# EAGLE design air quality (EAGLE 5.11)
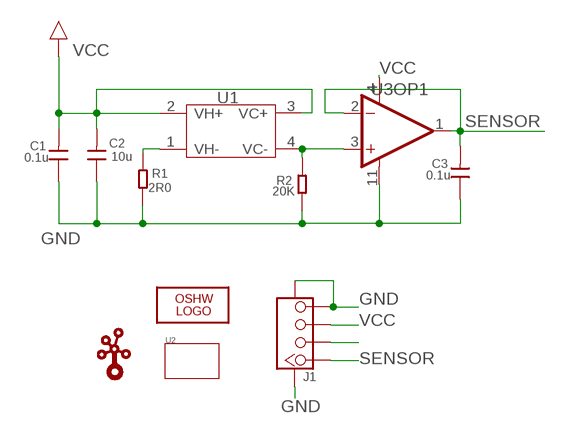
[diagram p0: schematic, sheet 1]

## Parts
C1  0.1u  C-0603  [0603]
C2  10u  C-0603  [0603]
C3  0.1u  C-0603  [0603]
J1  TWIG-4P-2.0-SMD-FEMALE-REINFORCE'90D'  [4P-SMD-2.0-90D]
LOGO1  LOGO-OSHW-FILLX0200-NT  [OSHW_FILLX200_NOTEXT]
R1  2R0  R-0805  [0805]
R2  20K  R-0603  [0603]
U1  SENSOR-TP-401  [4P-9.4MM]
U2  TWIG-2U  [2U-DIM-W/-DRILL]
U3  LMV324  [SO014]
U$1  LOGO-TWIG  [TWIGLOGO]

## Nets
GND: C1.1 C2.1 C3.1 J1.4 J1.SS1 J1.SS2 R1.1 R2.1 U3.11(OP1:V-)
N$1: R1.2 U1.1(VH-)
N$4: R2.2 U1.4(VC-) U3.3(OP1:IN+)
SENSOR: C3.2 J1.1 U3.1(OP1:OUT) U3.2(OP1:IN-)
TEMP: J1.2
VCC: C1.2 C2.2 J1.3 U1.2(VH+) U1.3(VC+) U3.4(OP1:V+) ; supply symbol labelled POWER_ARROW
Unconnected: U3.5(OP3:IN+) U3.6(OP3:IN-) U3.7(OP3:OUT) U3.8(OP2:OUT) U3.9(OP2:IN-) U3.10(OP2:IN+) U3.12(OP4:IN+) U3.13(OP4:IN-) U3.14(OP4:OUT)

## Library data of the parts
C1-C3 = Discrete:C*: Ceramic Capacitors
J1 = Connector:TWIG-4P-2.0-SMD-FEMALE-REINFORCE
LOGO1 = logo:LOGO-OSHW-FILL
R1 R2 = Discrete:R*
U1 = Discrete:SENSOR-TP-401
U2 = Module:TWIG
U3 = IC:LMV324
U$1 = logo:LOGO-TWIG

## Board
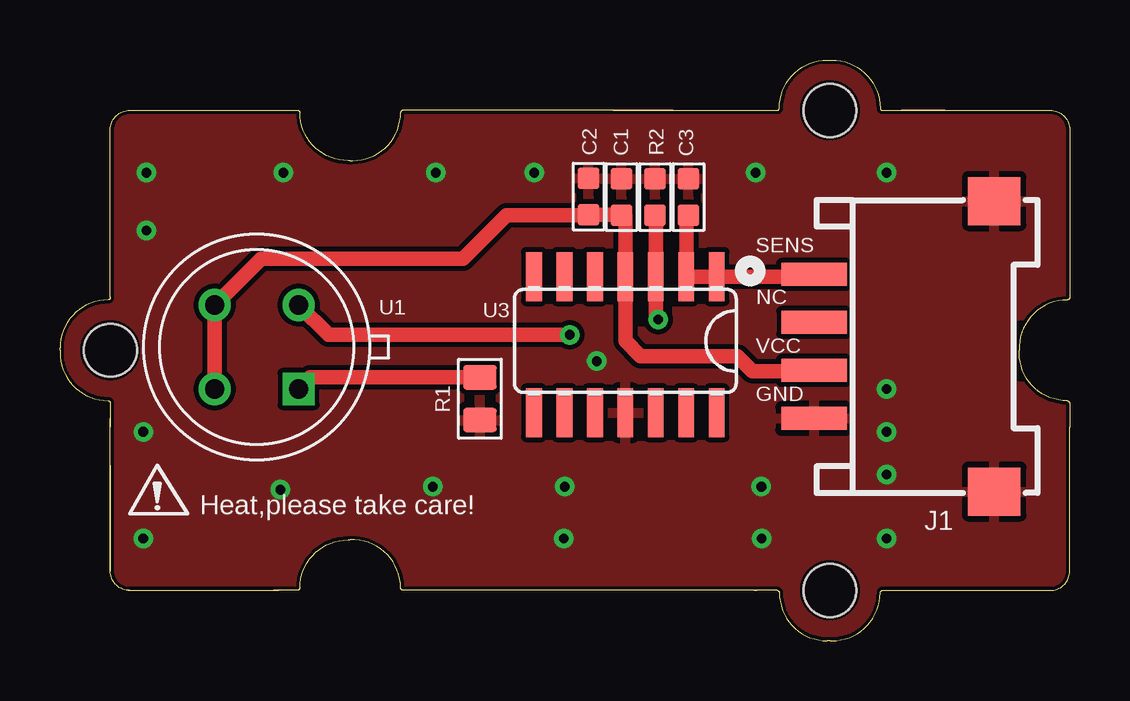
[diagram p1: board, top side]
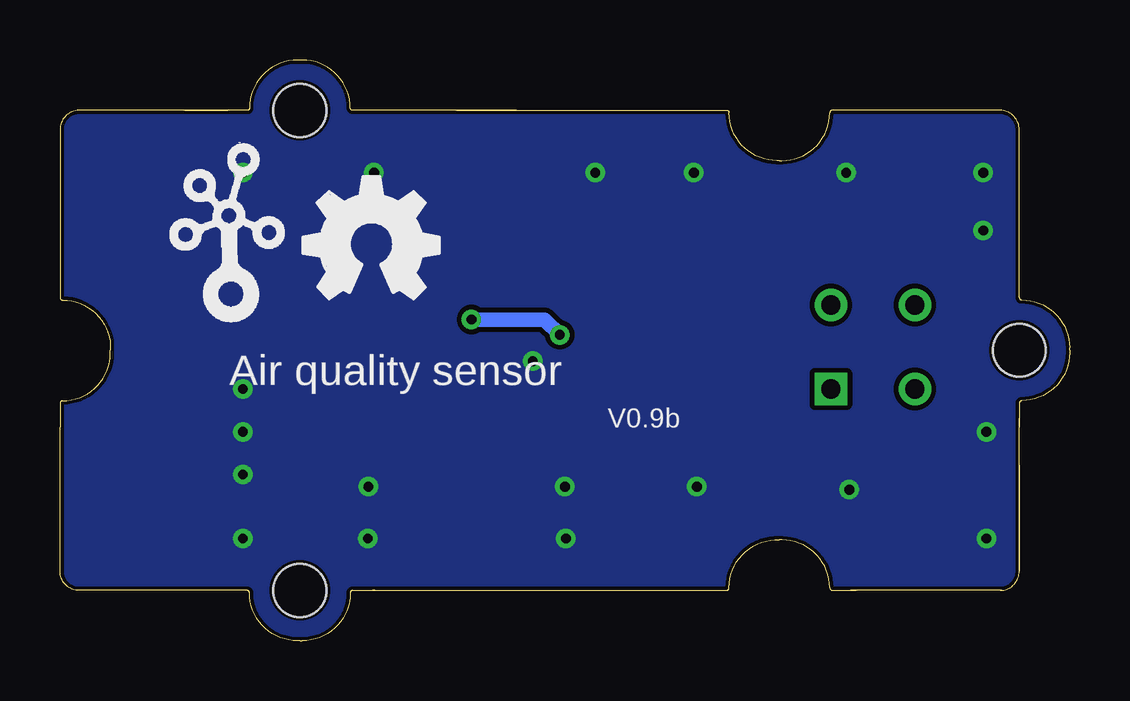
[diagram p2: board, bottom side, seen from below]

Size 42.09 x 24.2 mm. Coordinates in mm from the lower left corner, seen from the top.
Copper layers (1*16): Top 0.035mm / dielectric 1.5mm / Bottom 0.035mm
Design rules "default *": minimum track width 6mil, minimum drill 12mil, track to track 8mil, track to pad 8mil, pad to pad 8mil, via to via 8mil, smd to smd 8mil, copper to edge 6mil, drill to drill 8mil, minimum pad ring 10mil, minimum via ring 8mil, stop-mask expansion 4mil, vias tented up to drill 0mil, thermal gap 10mil

### Footprints (pad centres in the part's own frame; a part is rotated, then mirrored left to right if it is on the bottom)
0603 = smd 0.889 x 0.889: 1 -0.762,0; 2 0.762,0
4P-SMD-2.0-90D = smd 0.965 x 2.74: 1 -3,-0.1; 2 -1,-0.1; 3 1,-0.1; 4 3,-0.1 | smd 2 x 2.184: SS1 -6.05,7.4; SS2 6.05,7.4
0805 = smd 1.016 x 1.397: 1 -0.889,0; 2 0.889,0
4P-9.4MM = drill 0.8 pad 1.35 square: 1 -1.75,-1.75 | drill 0.8 pad 1.35 round: 2 -1.75,1.75; 3 1.75,1.75; 4 1.75,-1.75
2U-DIM-W/-DRILL = hole 2.2: 10.453,-10.42; 10.453,9.58; -19.535,-0.415
SO014 = smd 0.66 x 2.032: 1 -3.175,-2.68; 2 -1.905,-2.68; 3 -0.635,-2.68; 4 0.635,-2.68; 5 1.905,-2.68; 6 3.175,-2.68; 7 4.445,-2.68; 8 4.445,2.997; 9 3.175,2.997; 10 1.905,2.997; 11 0.635,2.997; 12 -0.635,2.997; 13 -1.905,2.997; 14 -3.175,2.997

### Placement (x,y rotation side)
C1  23.41,18.49 270 top
C2  22.03,18.51 270 top
C3  26.21,18.49 270 top
J1  31.54,12.27 270 top
LOGO1  31.95,14.25 0 bottom
R1  17.5,10.09 90 top
R2  24.81,18.49 270 top
U1  8.2,12.24 90 top
U2  21.64,12.52 0 top
U3  24.2,12.49 180 top
U$1  35.02,14.25 0 bottom

### Tracks (layer width: path | path; a pad name or v marks a point on that pad's centre or on a via)
GND  (via drill 0.41)
  other vias: 34.46,4.27 34.46,19.5 34.46,6.93 34.46,8.71 34.46,10.49 29,19.5 19.77,19.5 15.67,19.5 9.32,19.5 3.6,19.5 3.6,17.09 3.47,8.71 9.19,6.3 15.54,6.42 21,4.27 29.26,4.27 22.38,11.65 3.47,4.27 21.04,6.42 29.24,6.42
  pour Bottom: -2.37,25.22 45.64,25.22 45.64,-1.2 -2.37,-1.2
  pour Top: -2.37,25.22 45.64,25.22 45.64,-1.2 -2.37,-1.2
N$1
  Top 0.61: U1.1 10.43,10.98 R1.2
N$4  (via drill 0.41)
  Top 0.61: R2.2 24.84,17.7 U3.3 24.84,13.61 v24.94,13.38 | U1.4 11.19,12.75 v21.25,12.75
  Bottom 0.61: v21.25,12.75 21.89,13.38 v24.94,13.38
SENSOR
  Top 0.61: U3.2 26.08,15.2 | U3.2 U3.1 31.35,15.17 J1.1 | C3.2 26.11,17.7 U3.2
VCC
  Top 0.61: U1.2 U1.3 8.38,15.92 16.81,15.92 18.61,17.73 21.71,17.73 C2.2 23.4,17.74 C1.2 23.57,17.7 U3.4 23.57,12.49 24.2,11.86 28.24,11.86 28.87,11.22 31.4,11.22 J1.3

### Text on the board
tPlace: SENS | NC | VCC | GND | Heat,please take care!
bPlace: Air quality sensor | V0.9b